# Altium schematic sheet Sheet1.SchDoc
size A3
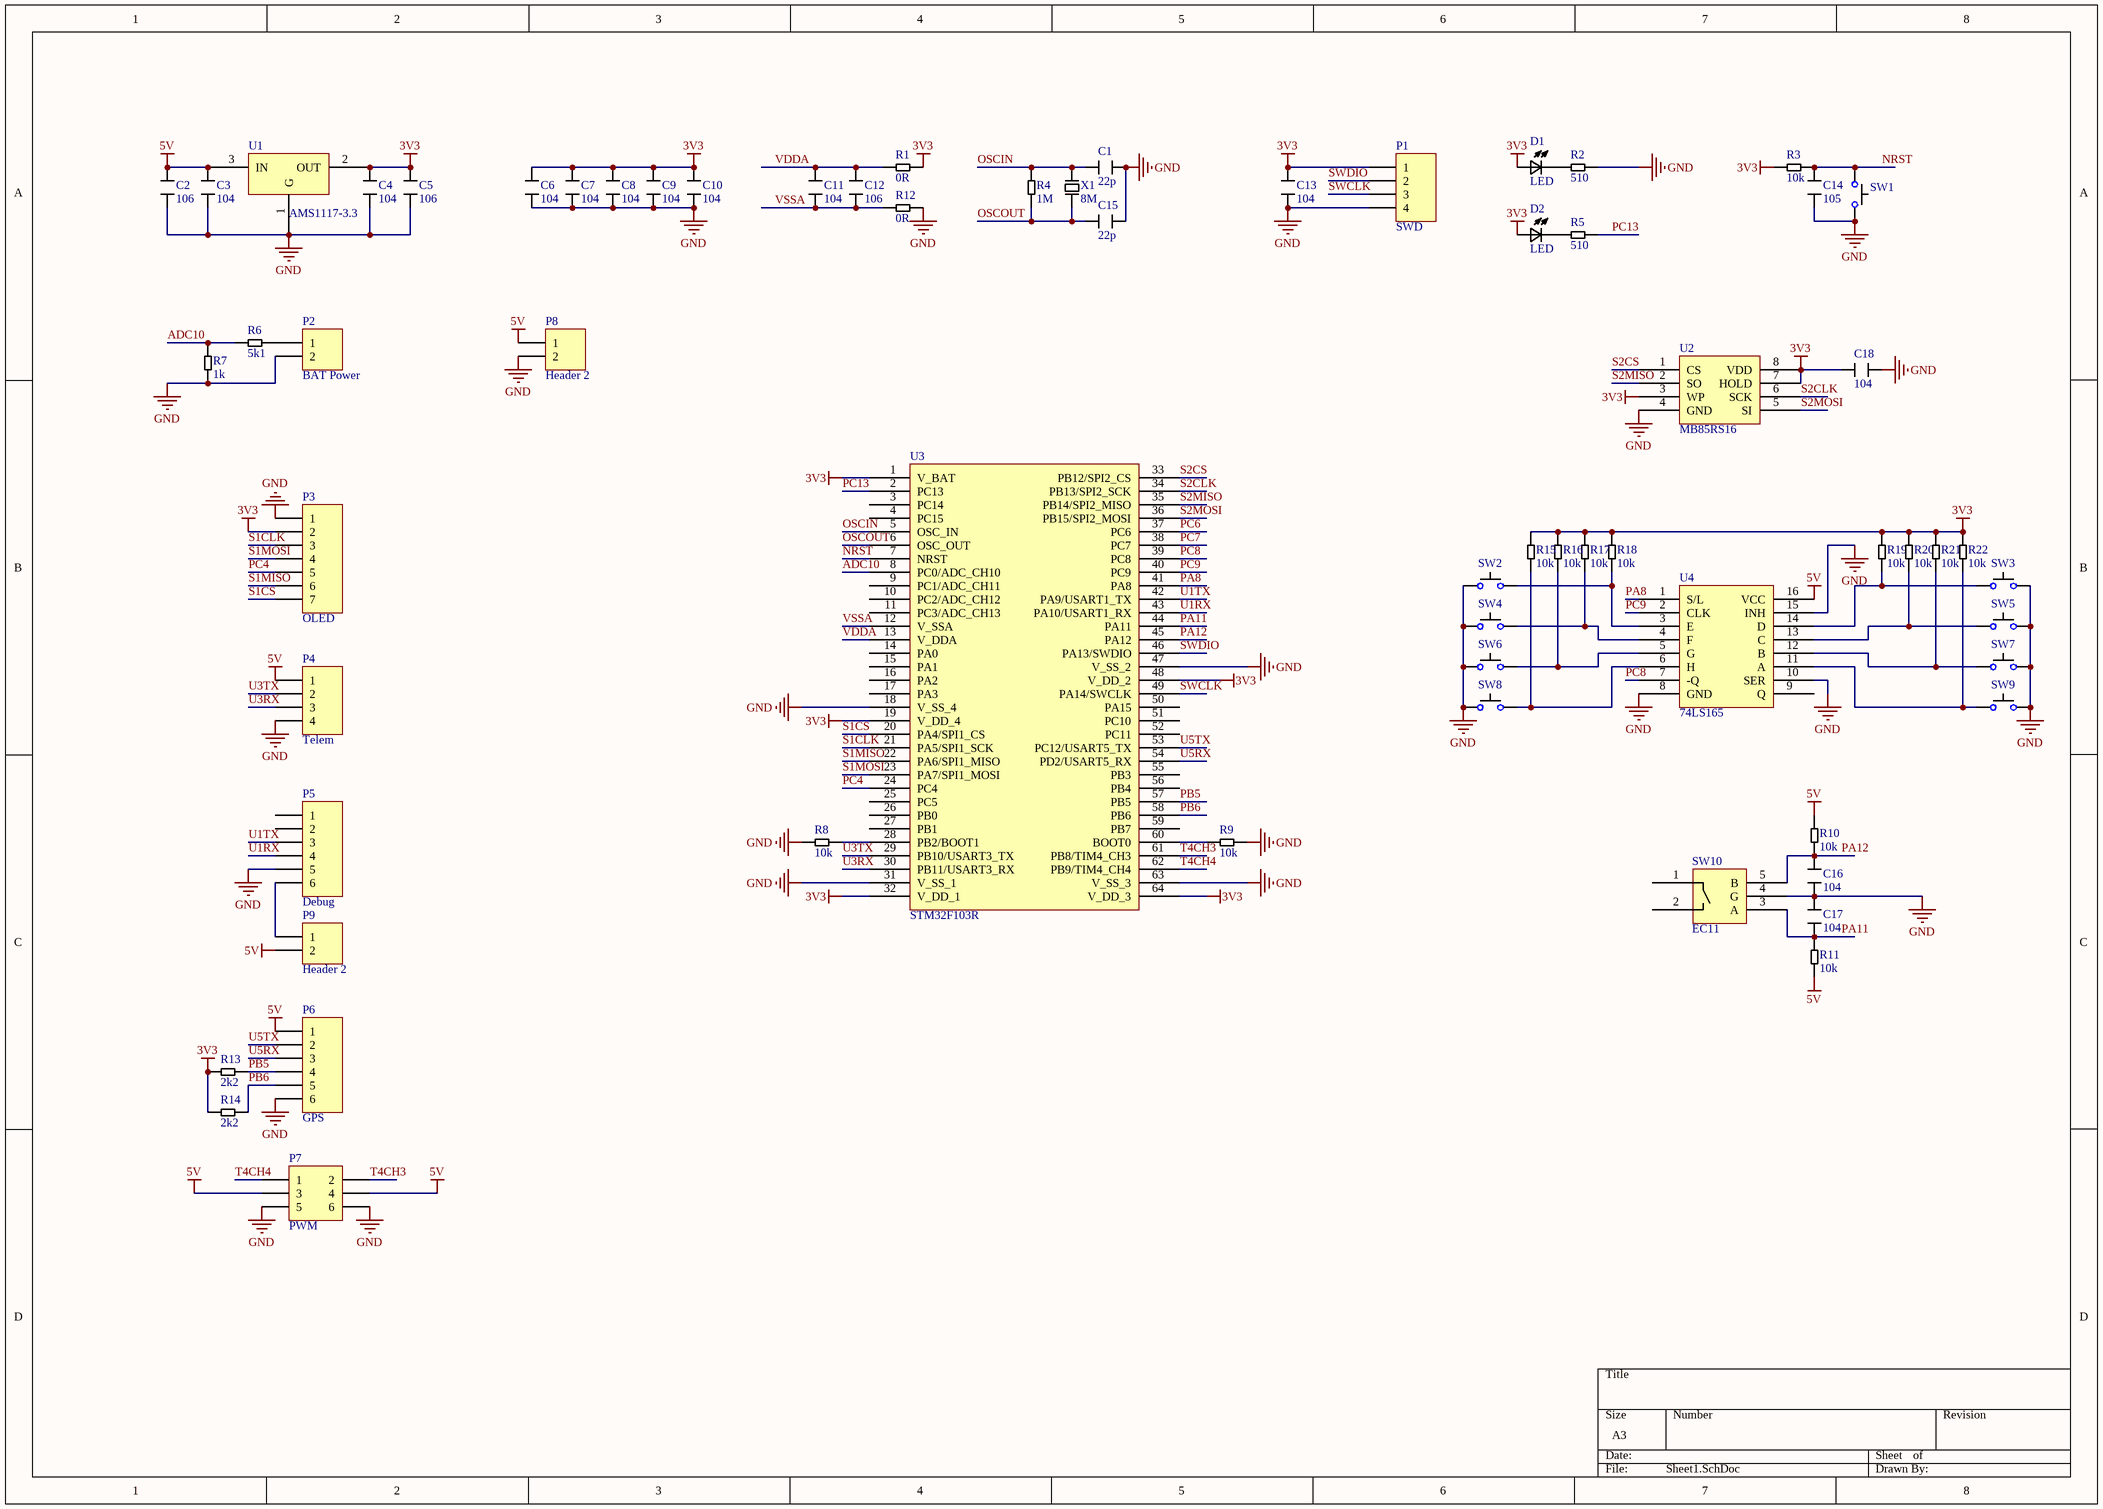
[diagram p0: Sheet1.SchDoc]

## Parts
C1  22p  [0805]
C2  106  [0805]
C3  104  [0805]
C4  104  [0805]
C5  106  [0805]
C6  104  [0805]
C7  104  [0805]
C8  104  [0805]
C9  104  [0805]
C10  104  [0805]
C11  104  [0805]
C12  106  [0805]
C13  104  [0805]
C14  105  [0805]
C15  22p  [0805]
C16  104  [0805]
C17  104  [0805]
C18  104  [0805]
D1  LED  [0805]
D2  LED  [0805]
P1  SWD  [HDR1X4]
P2  BAT Power  [HDR1X2]
P3  OLED  [HDR1X7]
P4  Telem  [HDR1X4]
P5  Debug  [HDR1X6]
P6  GPS  [HDR1X6]
P7  PWM  [HDR2X3]
P8  Header 2  [HDR1X2]
P9  Header 2  [HDR1X2]
R1  0R  [0805]
R2  510  [0805]
R3  10k  [0805]
R4  1M  [0805]
R5  510  [0805]
R6  5k1  [0805]
R7  1k  [0805]
R8  10k  [0805]
R9  10k  [0805]
R10  10k  [0805]
R11  10k  [0805]
R12  0R  [0805]
R13  2k2  [0805]
R14  2k2  [0805]
R15  10k  [0805]
R16  10k  [0805]
R17  10k  [0805]
R18  10k  [0805]
R19  10k  [0805]
R20  10k  [0805]
R21  10k  [0805]
R22  10k  [0805]
SW1  (no value)  [Btn]
SW2  (no value)  [Btn]
SW3  (no value)  [Btn]
SW4  (no value)  [Btn]
SW5  (no value)  [Btn]
SW6  (no value)  [Btn]
SW7  (no value)  [Btn]
SW8  (no value)  [Btn]
SW9  (no value)  [Btn]
SW10  EC11  [EC11]
U1  AMS1117-3.3  [SOT223]
U2  MB85RS16  [SOP8]
U3  STM32F103R  [LQFP64-M]
U4  74LS165  [SOP16]
X1  8M  [49SMD]

## Nets
3V3: C4.2 C5.2 C6.2 C7.2 C8.2 C9.2 C10.2 C13.2 C18.1 D1.1 D2.1 P1.1 P3.2 R1.2 R3.1 R13.1 R14.1 R15.2 R16.2 R17.2 R18.2 R19.2 R20.2 R21.2 R22.2 U1.2(OUT) U2.3(WP) U2.7(HOLD) U2.8(VDD) U3.1(V_BAT) U3.19(V_DD_4) U3.32(V_DD_1) U3.48(V_DD_2) U3.64(V_DD_3)
5V: C2.2 C3.2 P4.1 P6.1 P7.3 P7.4 P8.1 P9.2 R10.2 R11.1 U1.3(IN) U4.16(VCC)
GND: C1.2 C2.1 C3.1 C4.1 C5.1 C6.1 C7.1 C8.1 C9.1 C10.1 C13.1 C14.1 C15.2 C16.1 C17.2 C18.2 P1.4 P2.2 P3.1 P4.4 P5.5 P6.6 P7.5 P7.6 P8.2 R2.2 R7.1 R8.1 R9.2 R12.2 SW1.2 SW2.1 SW3.2 SW4.1 SW5.2 SW6.1 SW7.2 SW8.1 SW9.2 SW10.4(G) U1.1(G) U2.4(GND) U3.18(V_SS_4) U3.31(V_SS_1) U3.47(V_SS_2) U3.63(V_SS_3) U4.8(GND) U4.10(SER) U4.15(INH)
ADC10: R6.1 R7.2 U3.8(PC0/ADC_CH10)
NRST: C14.2 R3.2 SW1.1 U3.7(NRST)
OSCIN: C1.1 R4.2 U3.5(OSC_IN) X1.2
OSCOUT: C15.1 R4.1 U3.6(OSC_OUT) X1.1
PA8: U3.41(PA8) U4.1(S/L)
PA11: C17.1 R11.2 SW10.3(A) U3.44(PA11)
PA12: C16.2 R10.1 SW10.5(B) U3.45(PA12)
PB5: P6.4 R13.2 U3.57(PB5)
PB6: P6.5 R14.2 U3.58(PB6)
PC4: P3.5 U3.24(PC4)
PC6: U3.37(PC6)
PC7: U3.38(PC7)
PC8: U3.39(PC8) U4.7(-Q)
PC9: U3.40(PC9) U4.2(CLK)
PC13: R5.2 U3.2(PC13)
S1CLK: P3.3 U3.21(PA5/SPI1_SCK)
S1CS: P3.7 U3.20(PA4/SPI1_CS)
S1MISO: P3.6 U3.22(PA6/SPI1_MISO)
S1MOSI: P3.4 U3.23(PA7/SPI1_MOSI)
S2CLK: U2.6(SCK) U3.34(PB13/SPI2_SCK)
S2CS: U2.1(CS) U3.33(PB12/SPI2_CS)
S2MISO: U2.2(SO) U3.35(PB14/SPI2_MISO)
S2MOSI: U2.5(SI) U3.36(PB15/SPI2_MOSI)
SWCLK: P1.3 U3.49(PA14/SWCLK)
SWDIO: P1.2 U3.46(PA13/SWDIO)
T4CH3: P7.2 U3.61(PB8/TIM4_CH3)
T4CH4: P7.1 U3.62(PB9/TIM4_CH4)
U1RX: P5.4 U3.43(PA10/USART1_RX)
U1TX: P5.3 U3.42(PA9/USART1_TX)
U3RX: P4.3 U3.30(PB11/USART3_RX)
U3TX: P4.2 U3.29(PB10/USART3_TX)
U5RX: P6.3 U3.54(PD2/USART5_RX)
U5TX: P6.2 U3.53(PC12/USART5_TX)
VDDA: C11.2 C12.2 R1.1 U3.13(V_DDA)
VSSA: C11.1 C12.1 R12.1 U3.12(V_SSA)
NetD1_2: D1.2 R2.1
NetD2_2: D2.2 R5.1
NetP2_1: P2.1 R6.2
NetP5_6: P5.6 P9.1
NetR8_2: R8.2 U3.28(PB2/BOOT1)
NetR9_1: R9.1 U3.60(BOOT0)
NetR15_1: R15.1 SW8.2 U4.6(H)
NetR16_1: R16.1 SW6.2 U4.5(G)
NetR17_1: R17.1 SW4.2 U4.4(F)
NetR18_1: R18.1 SW2.2 U4.3(E)
NetR19_1: R19.1 SW3.1 U4.14(D)
NetR20_1: R20.1 SW5.1 U4.13(C)
NetR21_1: R21.1 SW7.1 U4.12(B)
NetR22_1: R22.1 SW9.1 U4.11(A)

Not connected (* = marked no-connect by the designer): P5 1 2; SW10 1(K) 2(A); U3 3(PC14) 4(PC15) 9(PC1/ADC_CH11) 10(PC2/ADC_CH12) 11(PC3/ADC_CH13) 14(PA0) 15(PA1) 16(PA2) 17(PA3) 25(PC5) 26(PB0) 27(PB1) 50(PA15) 51(PC10) 52(PC11) 55(PB3) 56(PB4) 59(PB7); U4 9(Q)

## Notes on the sheet
- Title
- Size:
- Date:
- A3
- Number:
- Time:
- Revision:
- Sheet
- of
- File:

## Library data of the parts
C1-C18 = Cap
P1 P4 = Header 4: Header, 4-Pin; LatestRevisionDate: 17-Jul-2002; LatestRevisionNote: Re-released for DXP Platform.; Publisher: Altium Limited
P2 P8 P9 = Header 2: Header, 2-Pin; LatestRevisionDate: 17-Jul-2002; LatestRevisionNote: Re-released for DXP Platform.; Publisher: Altium Limited
P3 = Header 7: Header, 7-Pin; LatestRevisionDate: 17-Jul-2002; LatestRevisionNote: Re-released for DXP Platform.; Publisher: Altium Limited
P5 P6 = Header 6: Header, 6-Pin; LatestRevisionDate: 17-Jul-2002; LatestRevisionNote: Re-released for DXP Platform.; Publisher: Altium Limited
P7 = Header 3X2: Header, 3-Pin, Dual row; LatestRevisionDate: 17-Jul-2002; LatestRevisionNote: Re-released for DXP Platform.; Publisher: Altium Limited
R1-R22 = Res
SW1-SW9 = Btn
X1 = XTAL